# EAGLE design M-Controller_REV-B (EAGLE 7.6.0)
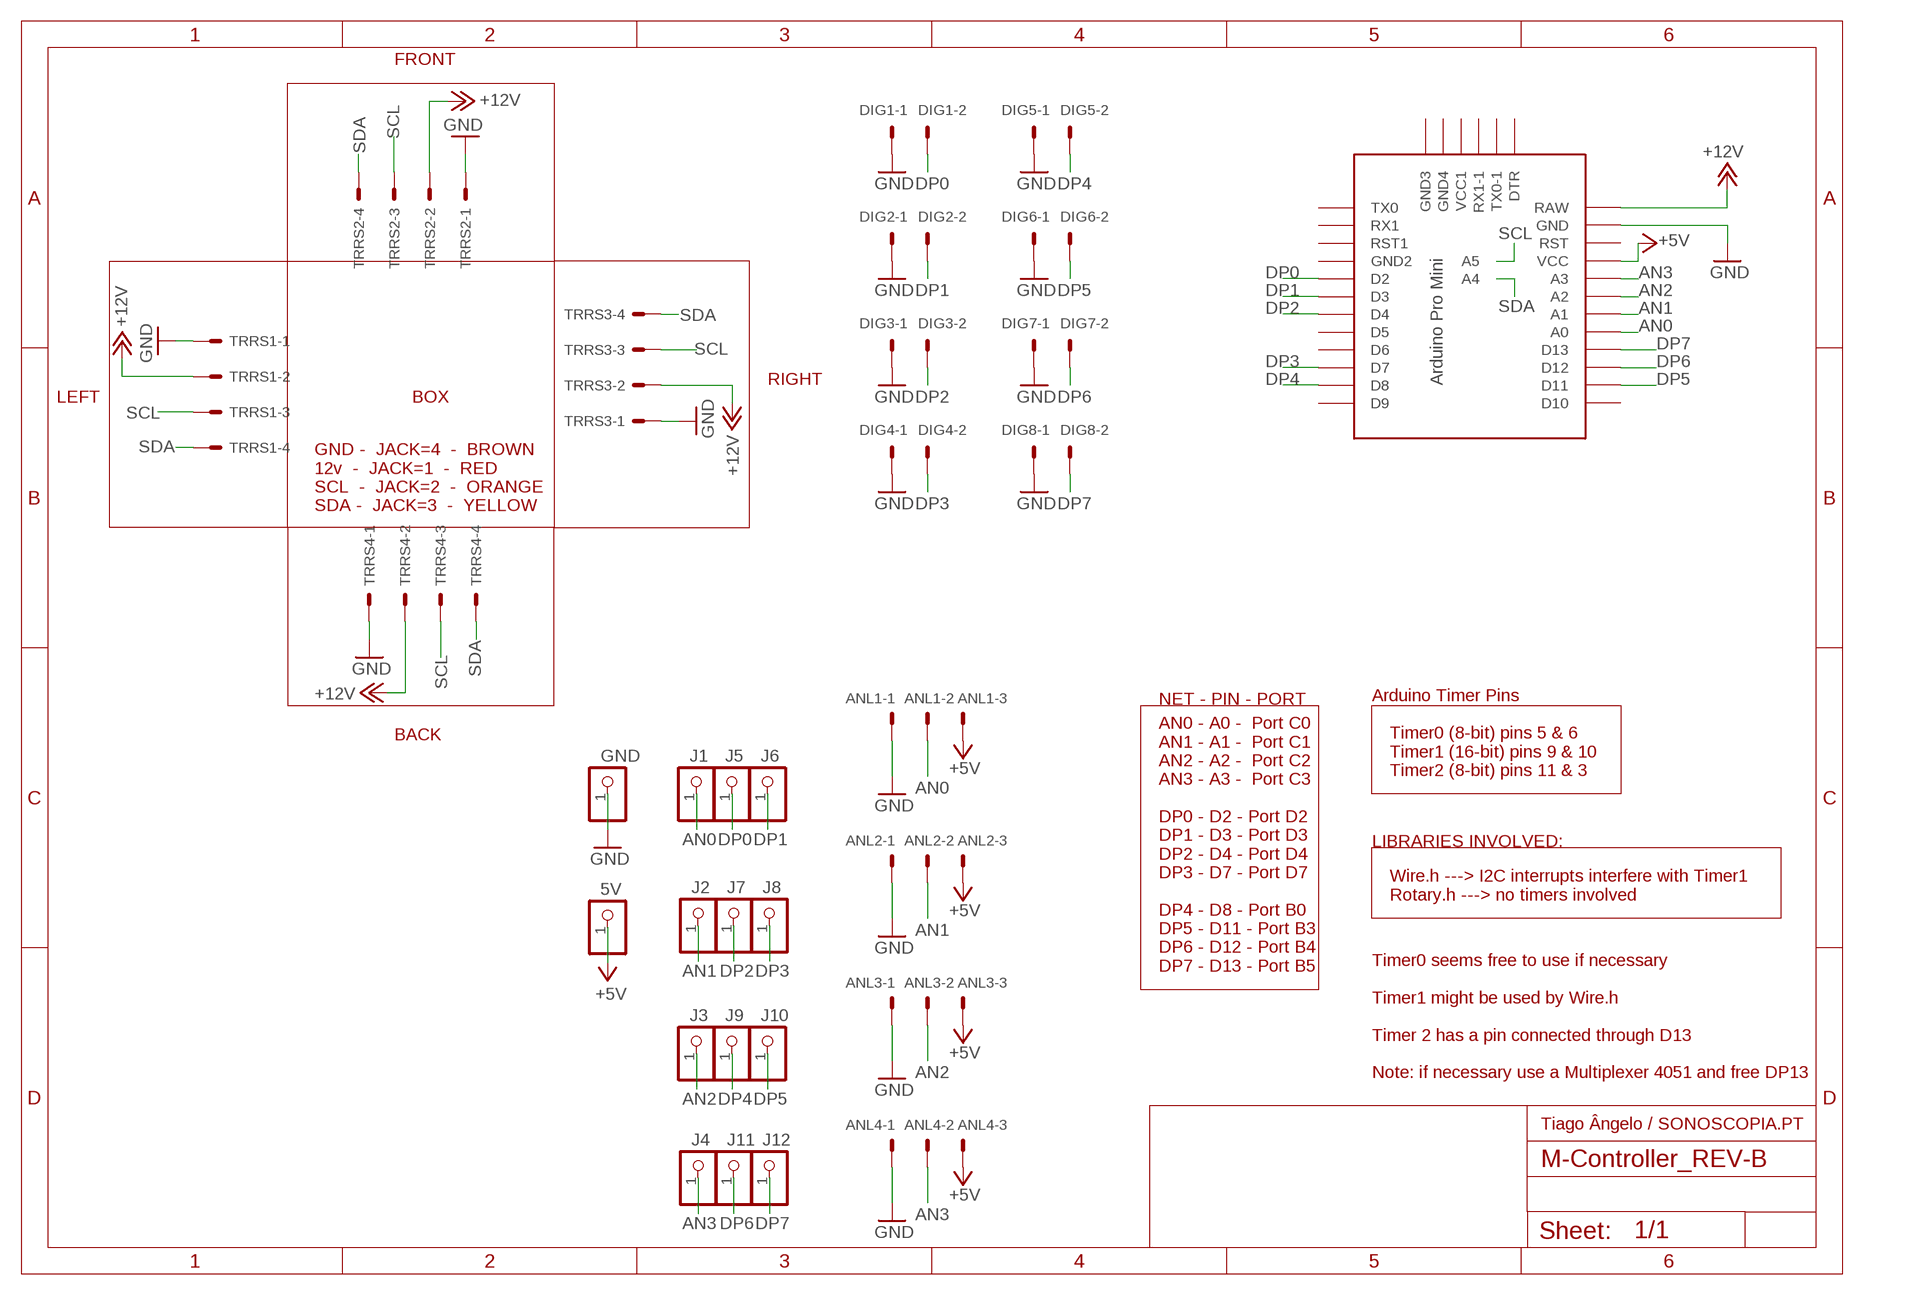
[diagram p0: schematic, sheet 1]

## Parts
5V  PINHD-1X1  [1X01]
ANL1  22-27-2031-03  [6410-03]
ANL2  22-27-2031-03  [6410-03]
ANL3  22-27-2031-03  [6410-03]
ANL4  22-27-2031-03  [6410-03]
DIG1  22-27-2021-02  [6410-02]
DIG2  22-27-2021-02  [6410-02]
DIG3  22-27-2021-02  [6410-02]
DIG4  22-27-2021-02  [6410-02]
DIG5  22-27-2021-02  [6410-02]
DIG6  22-27-2021-02  [6410-02]
DIG7  22-27-2021-02  [6410-02]
DIG8  22-27-2021-02  [6410-02]
GND  PINHD-1X1  [1X01]
J1  PINHD-1X1  [1X01]
J2  PINHD-1X1  [1X01]
J3  PINHD-1X1  [1X01]
J4  PINHD-1X1  [1X01]
J5  PINHD-1X1  [1X01]
J6  PINHD-1X1  [1X01]
J7  PINHD-1X1  [1X01]
J8  PINHD-1X1  [1X01]
J9  PINHD-1X1  [1X01]
J10  PINHD-1X1  [1X01]
J11  PINHD-1X1  [1X01]
J12  PINHD-1X1  [1X01]
TRRS1  22-27-2041-04  [6410-04]
TRRS2  22-27-2041-04  [6410-04]
TRRS3  22-27-2041-04  [6410-04]
TRRS4  22-27-2041-04  [6410-04]
U$1  PRO-MINI-2  [PRO-MINI-2]

## Nets
+5V: 5V.1 ANL1.3 ANL2.3 ANL3.3 ANL4.3 U$1.VCC
+12V: TRRS1.2 TRRS2.2 TRRS3.2 TRRS4.2 U$1.RAW
AN0: ANL1.2 J1.1 U$1.A0
AN1: ANL2.2 J2.1 U$1.A1
AN2: ANL3.2 J3.1 U$1.A2
AN3: ANL4.2 J4.1 U$1.A3
DP0: DIG1.2 J5.1 U$1.D2
DP1: DIG2.2 J6.1 U$1.D3
DP2: DIG3.2 J7.1 U$1.D4
DP3: DIG4.2 J8.1 U$1.D7
DP4: DIG5.2 J9.1 U$1.D8
DP5: DIG6.2 J10.1 U$1.D11
DP6: DIG7.2 J11.1 U$1.D12
DP7: DIG8.2 J12.1 U$1.D13
GND: ANL1.1 ANL2.1 ANL3.1 ANL4.1 DIG1.1 DIG2.1 DIG3.1 DIG4.1 DIG5.1 DIG6.1 DIG7.1 DIG8.1 GND.1 TRRS1.1 TRRS2.1 TRRS3.1 TRRS4.1 U$1.GND
SCL: TRRS1.3 TRRS2.3 TRRS3.3 TRRS4.3 U$1.A5
SDA: TRRS1.4 TRRS2.4 TRRS3.4 TRRS4.4 U$1.A4
Unconnected: U$1.D5 U$1.D6 U$1.D9 U$1.D10 U$1.DTR U$1.GND1(GND2) U$1.GND2(GND3) U$1.GND3(GND4) U$1.RST U$1.RST1 U$1.RX1 U$1.RX1-1 U$1.TX0 U$1.TX0-1 U$1.VCC1

## Notes on the sheet
- FRONT
- RIGHT
- LEFT | BOX
- GND -  JACK=4  -  BROWN
  12v  -  JACK=1  -  RED
  SCL  -  JACK=2  -  ORANGE
  SDA -  JACK=3  -  YELLOW
- NET - PIN - PORT | Arduino Timer Pins
- BACK
- Timer0 (8-bit) pins 5 & 6
  Timer1 (16-bit) pins 9 & 10 
  Timer2 (8-bit) pins 11 & 3
- LIBRARIES INVOLVED:
- Wire.h ---> I2C interrupts interfere with Timer1
  Rotary.h ---> no timers involved
- AN0 - A0 -  Port C0
  AN1 - A1 -  Port C1
  AN2 - A2 -  Port C2
  AN3 - A3 -  Port C3 
  
  DP0 - D2 - Port D2
  DP1 - D3 - Port D3
  DP2 - D4 - Port D4
  DP3 - D7 - Port D7
  
  DP4 - D8 - Port B0
  DP5 - D11 - Port B3
  DP6 - D12 - Port B4
  DP7 - D13 - Port B5
- Timer0 seems free to use if necessary 
  
  Timer1 might be used by Wire.h
  
  Timer 2 has a pin connected through D13
  
  Note: if necessary use a Multiplexer 4051 and free DP13
- Tiago Ângelo / SONOSCOPIA.PT

## Library data of the parts
5V GND J1-J12 = adafruit:PINHD-1X1: Pin header 1x1 for 0.1" spacing With round pins
ANL1-ANL4 = _M-BLOCKS:22-?-03: CONNECTOR wire to board 2.54 mm (.1 inch) pitch header
DIG1-DIG8 = _M-BLOCKS:22-?-02: CONNECTOR wire to board 2.54 mm (.1 inch) pitch header
TRRS1-TRRS4 = _M-BLOCKS:22-?-04: CONNECTOR wire to board 2.54 mm (.1 inch) pitch header
U$1 = _M-BLOCKS:PRO-MINI-2: Arduino Pro Mini Layout 2 Sparkfun.com

## Board
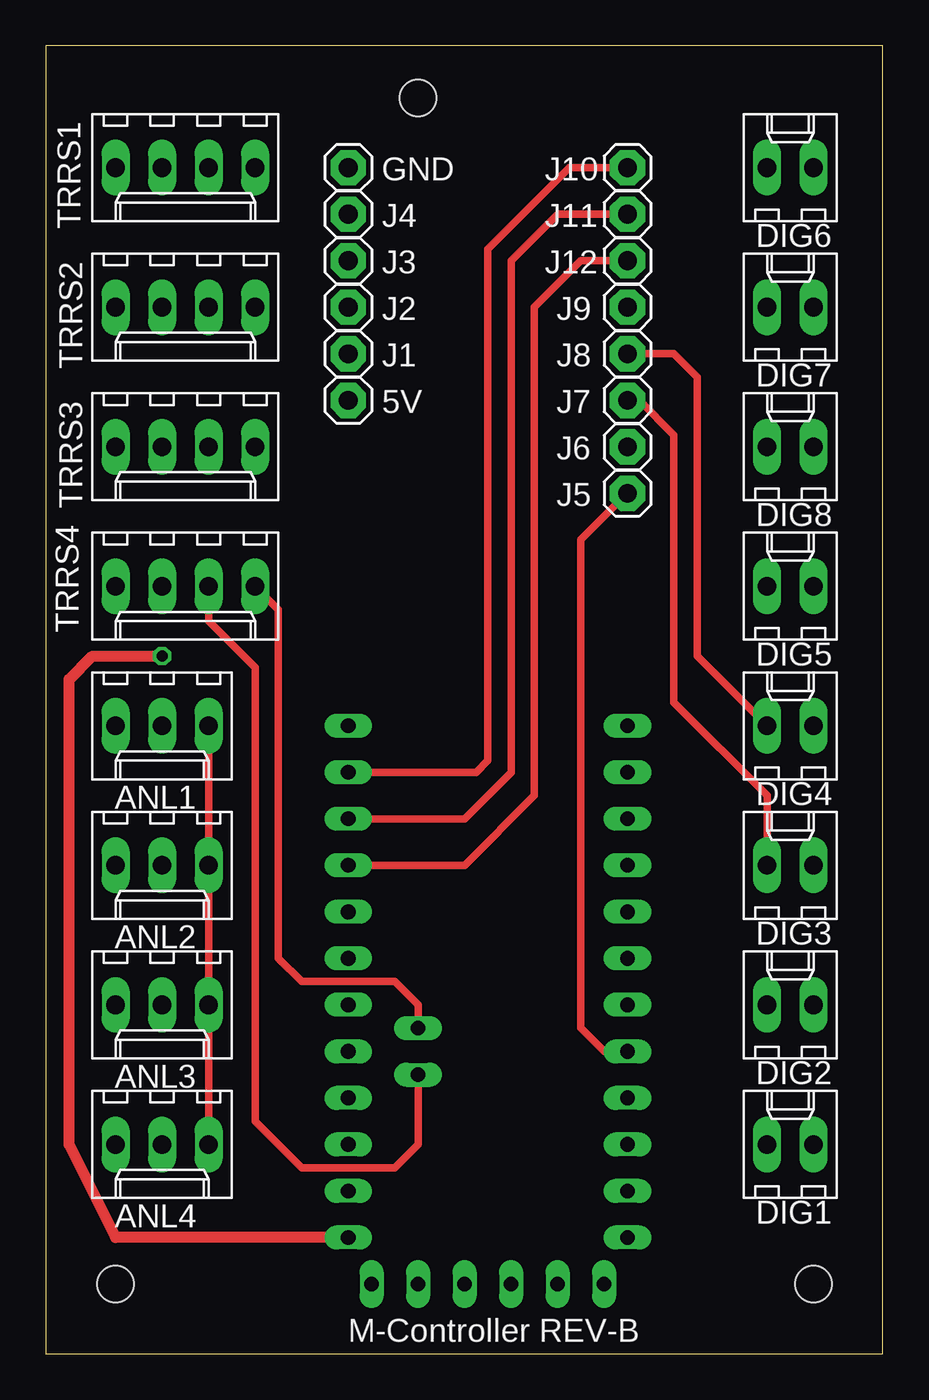
[diagram p1: board, top side]
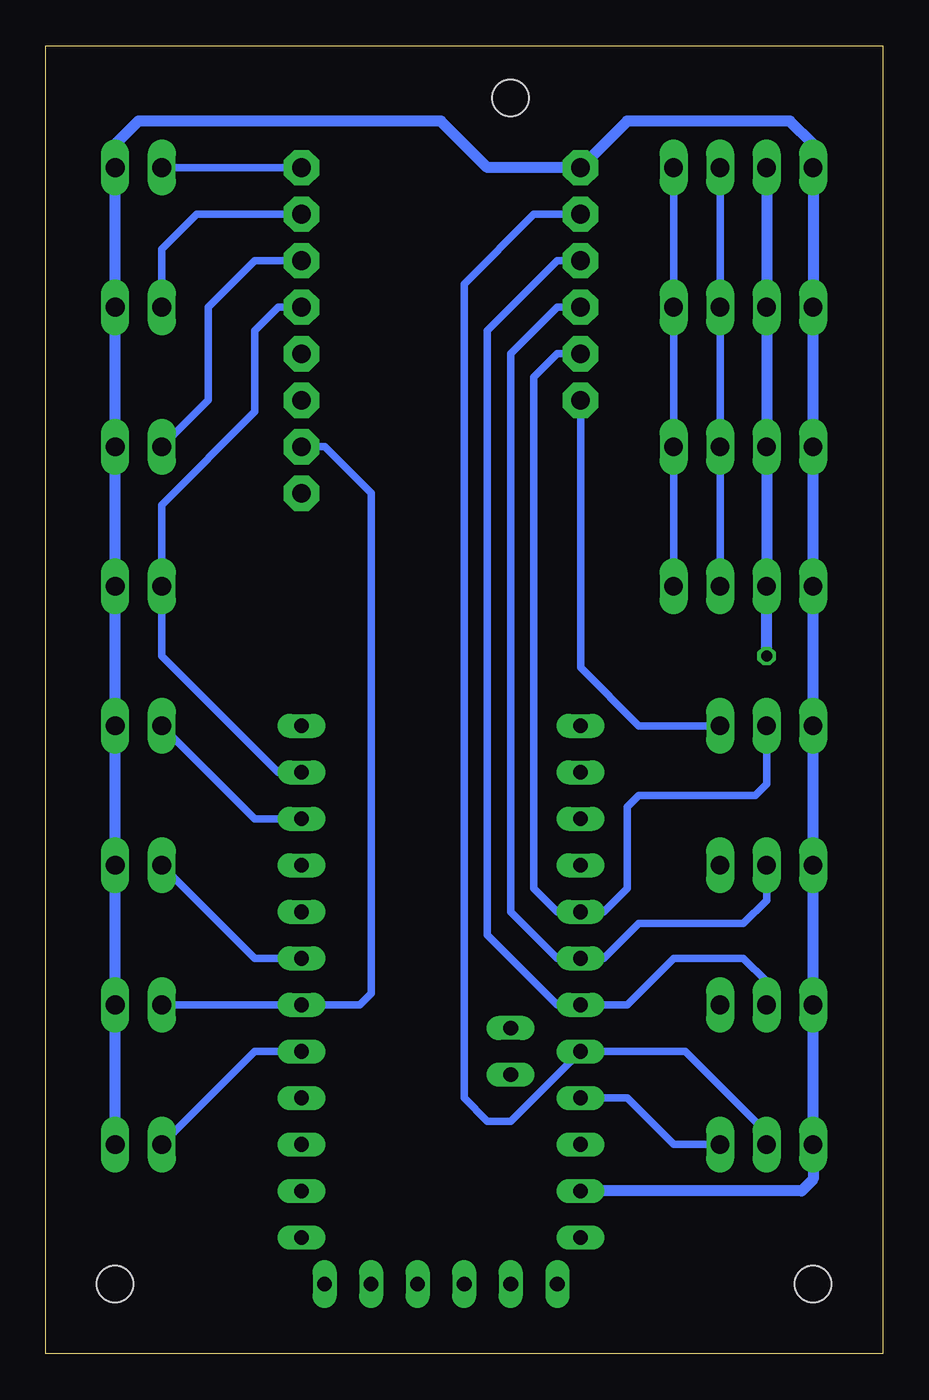
[diagram p2: board, bottom side, seen from below]

Size 45.7 x 71.42 mm. Coordinates in mm from the lower left corner, seen from the top.
Outline: 0,0 45.7,0 45.7,71.42 0,71.42 0,0
Copper layers (1*16): Top 0.035mm / dielectric 1.5mm / Bottom 0.035mm
Design rules "default": minimum track width 10mil, minimum drill 24mil, track to track 8mil, track to pad 8mil, pad to pad 8mil, via to via 8mil, smd to smd 8mil, copper to edge 40mil, drill to drill 8mil, minimum pad ring 10mil, minimum via ring 8mil, stop-mask expansion 4mil, vias tented up to drill 0mil, thermal gap 10mil
Holes 2 mm at 3.81,3.81 20.32,68.58 41.91,3.81

### Footprints (pad centres in the part's own frame; a part is rotated, then mirrored left to right if it is on the bottom)
1X01 = drill 1.016 pad 1.93 octagon: 1 0,0
6410-03 = drill 1.016 long: 1 2.54,0; 2 0,0; 3 -2.54,0
6410-02 = drill 1.016 long: 1 1.27,0; 2 -1.27,0
6410-04 = drill 1.016 long: 1 3.81,0; 2 1.27,0; 3 -1.27,0; 4 -3.81,0
PRO-MINI-2 = drill 0.8 long: A0 6.35,-5.08; A1 6.35,-2.54; A2 6.35,0; A3 6.35,2.54; A4 2.54,1.27; A5 2.54,3.81; D2 -8.89,2.54; D3 -8.89,0; D4 -8.89,-2.54; D5 -8.89,-5.08; D6 -8.89,-7.62; D7 -8.89,-10.16; D8 -8.89,-12.7; D9 -8.89,-15.24; D10 6.35,-15.24; D11 6.35,-12.7; D12 6.35,-10.16; D13 6.35,-7.62; DTR 5.08,15.24; GND 6.35,10.16; GND1 -8.89,5.08; GND2 -7.62,15.24; GND3 -5.08,15.24; RAW 6.35,12.7; RST 6.35,7.62; RST1 -8.89,7.62; RX1 -8.89,10.16; RX1-1 0,15.24; TX0 -8.89,12.7; TX0-1 2.54,15.24; VCC 6.35,5.08; VCC1 -2.54,15.24

### Placement (x,y rotation side)
5V  16.51,52.07 0 top
ANL1  6.35,34.29 180 top
ANL2  6.35,26.67 180 top
ANL3  6.35,19.05 180 top
ANL4  6.35,11.43 180 top
DIG1  40.64,11.43 0 top
DIG2  40.64,19.05 0 top
DIG3  40.64,26.67 0 top
DIG4  40.64,34.29 0 top
DIG5  40.64,41.91 0 top
DIG6  40.64,64.77 0 top
DIG7  40.64,57.15 0 top
DIG8  40.64,49.53 0 top
GND  16.51,64.77 0 top
J1  16.51,54.61 0 top
J2  16.51,57.15 0 top
J3  16.51,59.69 0 top
J4  16.51,62.23 0 top
J5  31.75,46.99 0 top
J6  31.75,49.53 0 top
J7  31.75,52.07 0 top
J8  31.75,54.61 0 top
J9  31.75,57.15 0 top
J10  31.75,64.77 0 top
J11  31.75,62.23 0 top
J12  31.75,59.69 0 top
TRRS1  7.62,64.77 180 top
TRRS2  7.62,57.15 180 top
TRRS3  7.62,49.53 180 top
TRRS4  7.62,41.91 180 top
U$1  22.86,19.05 180 top

### Tracks (layer width: path | path; a pad name or v marks a point on that pad's centre or on a via)
+5V
  Top 0.406: ANL4.3 ANL3.3 ANL2.3 ANL1.3
  Bottom 0.406: ANL4.3 11.43,11.43 13.97,13.97 U$1.VCC | 5V.1 16.51,37.47 13.34,34.29 ANL1.3
+12V  (via drill 0.6)
  Top 0.61: U$1.RAW 3.81,6.35 1.27,11.43 1.27,36.83 2.54,38.1 v6.35,38.1
  Bottom 0.61: TRRS1.2 TRRS2.2 TRRS3.2 TRRS4.2 v6.35,38.1
AN0
  Bottom 0.406: ANL1.2 6.35,31.11 6.99,30.48 13.34,30.48 13.97,29.84 13.97,25.4 15.24,24.13 U$1.A0 17.78,24.13 19.05,25.4 19.05,53.34 17.78,54.61 J1.1
AN1
  Bottom 0.406: ANL2.2 6.35,24.77 7.62,23.5 13.34,23.5 15.24,21.59 U$1.A1 17.78,21.59 20.32,24.13 20.32,54.61 17.78,57.15 J2.1
AN2
  Bottom 0.406: ANL3.2 6.35,20.32 7.62,21.59 11.43,21.59 13.97,19.05 U$1.A2 17.78,19.05 21.59,22.86 21.59,55.88 17.78,59.69 J3.1
AN3
  Bottom 0.406: ANL4.2 6.35,12.06 10.79,16.51 U$1.A3 20.32,12.7 21.59,12.7 22.86,13.97 22.86,58.42 19.05,62.23 J4.1
DP0
  Top 0.406: U$1.D2 30.48,16.51 29.21,17.78 29.21,44.45 J5.1
  Bottom 0.406: DIG1.2 34.29,16.51 U$1.D2
DP1
  Bottom 0.406: DIG2.2 U$1.D3 28.57,19.05 27.94,19.68 27.94,46.99 30.48,49.53 J6.1
DP2
  Top 0.406: DIG3.2 39.37,30.48 34.29,35.56 34.29,50.16 32.38,52.07 J7.1
  Bottom 0.406: DIG3.2 34.29,21.59 U$1.D4
DP3
  Top 0.406: J8.1 34.29,54.61 35.56,53.34 35.56,38.1 DIG4.2
  Bottom 0.406: DIG4.2 34.29,29.21 U$1.D7
DP4
  Bottom 0.406: J9.1 33.02,57.15 34.29,55.88 34.29,51.44 39.37,46.35 DIG5.2 39.37,38.1 33.02,31.75 U$1.D8
DP5
  Top 0.406: J10.1 28.57,64.77 24.13,60.33 24.13,32.38 23.5,31.75 U$1.D11
  Bottom 0.406: DIG6.2 J10.1
DP6
  Top 0.406: J11.1 27.94,62.23 25.4,59.69 25.4,31.75 22.86,29.21 U$1.D12
  Bottom 0.406: DIG7.2 39.37,60.33 37.47,62.23 J11.1
DP7
  Top 0.406: J12.1 29.21,59.69 26.67,57.15 26.67,30.48 22.86,26.67 U$1.D13
  Bottom 0.406: J12.1 34.29,59.69 36.83,57.15 36.83,52.07 DIG8.2
GND
  Bottom 0.61: DIG1.1 DIG2.1 DIG3.1 DIG4.1 DIG5.1 DIG8.1 DIG7.1 DIG6.1 41.91,66.04 40.64,67.31 24.13,67.31 21.59,64.77 GND.1 13.97,67.31 5.08,67.31 3.81,66.04 TRRS1.1 TRRS2.1 TRRS3.1 TRRS4.1 ANL1.1 ANL2.1 ANL3.1 ANL4.1 3.81,9.53 4.45,8.89 U$1.GND
SCL
  Top 0.406: U$1.A5 20.32,11.43 19.05,10.16 13.97,10.16 11.43,12.7 11.43,37.47 8.89,40.01 TRRS4.3
  Bottom 0.406: TRRS1.3 TRRS2.3 TRRS3.3 TRRS4.3
SDA
  Top 0.406: U$1.A4 20.32,19.05 19.05,20.32 13.97,20.32 12.7,21.59 12.7,40.64 TRRS4.4
  Bottom 0.406: TRRS1.4 TRRS2.4 TRRS3.4 TRRS4.4

### Text on the board
tNames: M-Controller REV-B